# EasyEDA schematic SCH_NAVVIBE_2026-03-12.json
TITLE: Navvibe; REV: 1.0; Date: 2026-03-04; Sheet: 1/1; Drawn By: siudin22; Company: Your Company
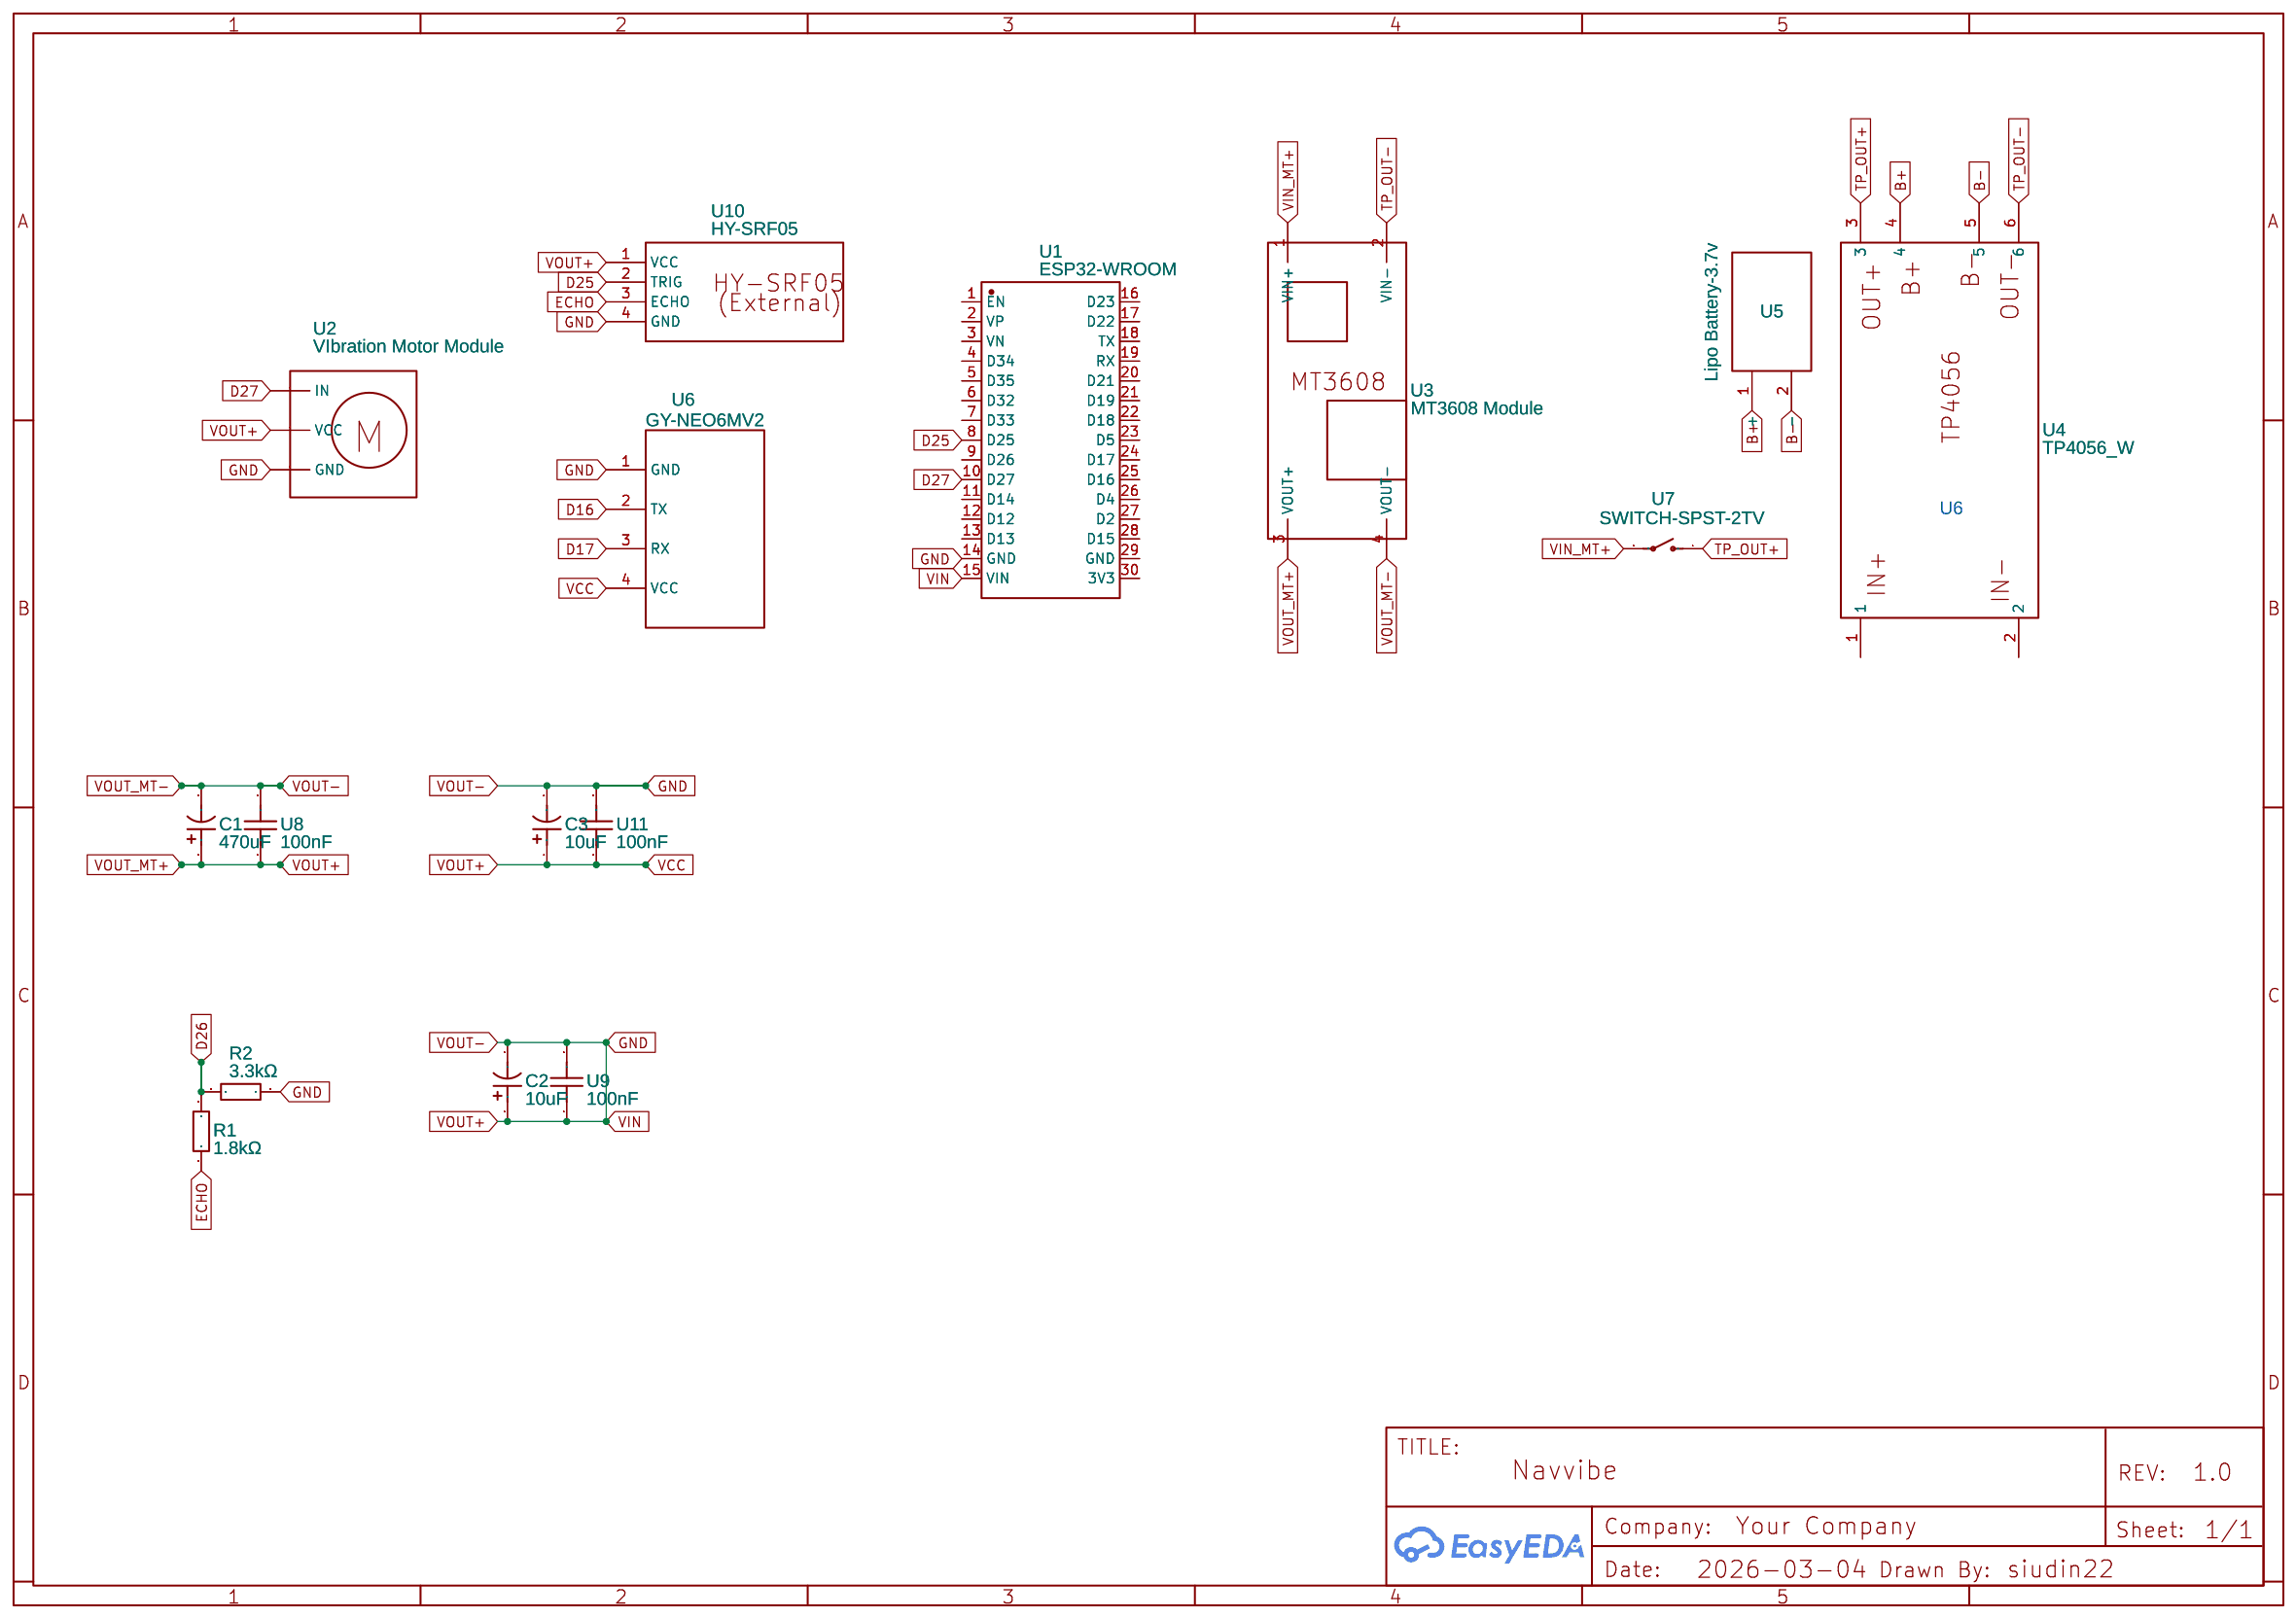
[diagram p0: schematic sheet]

## Parts
C1  470uF  [CAP-TH_BD6.0-P2.50-D0.5-FD]
C2  10uF  [CAP-TH_BD5.0-P2.00-D0.5-FD_RYHG35V10UF]
C3  10uF  [CAP-TH_BD5.0-P2.00-D0.5-FD_RYHG35V10UF]
R1  1.8kΩ  [RES-TH_BD3.3-L9.0-P13.00-D0.6]
R2  3.3kΩ  [RES-TH_BD3.3-L9.0-P13.00-D0.6]
U1  ESP32-WROOM  [ESP32 WROOM-32 ESP32-S JOY-IT]
U2  VIbration Motor Module  [VIBRATION MOTOR MODULE]
U3  MT3608 Module  [MT3608]
U4  TP4056_W  [TP4056_W]
U5  Lipo Battery-3.7v  [LIPO BATTERY-3.7V]
U6  GY-NEO6MV2  [GY-NEO6MV2]
U7  SWITCH-SPST-2TV  [SWITCH-SPST-VERTICAL]
U8  100nF  [CAP-TH_L12.0-W5.0-P10.00-D1.0]
U9  100nF  [CAP-TH_L12.0-W5.0-P10.00-D1.0]
U10  HY-SRF05  [HY_SRF05]
U11  100nF  [CAP-TH_L12.0-W5.0-P10.00-D1.0]

## Library data of the parts
C1 = 10V470UF CD288: Contributor: lcsc; Supplier: LCSC; Supplier Part: C2960213; Manufacturer: HRK(鸿瑞凯电子); Manufacturer Part: 10V470uF CD288; JLCPCB Part Class: Extended Part
C2 C3 = RYHG35V10UF5*8: Supplier: LCSC; Supplier Part: C48970423; Manufacturer: HONOR(荣誉); JLCPCB Part Class: Extended Part; Contributor: lcsc
R1 R2 = RN1/2W1.8KΩFT/BA1: Contributor: LCSC; Supplier: LCSC; Supplier Part: C385559; Manufacturer: Tyohm(幸亚电阻); JLCPCB Part Class: Extended Part
U1 = ESP32-WROOM: Supplier Part: C571181; Manufacturer: ESPRESSIF(乐鑫); Manufacturer Part: ESP32 WROOM-32 ESP32-S; JLCPCB Part Class: Extended Part; Contributor: maciekhka
U2 = VIbration Motor Module: Contributor: thomasdrive04
U3 = MT3608 Module: Supplier: Aliexpress; Contributor: Athantos
U4 = TP4056_W: Contributor: igor040885
U5 = Lipo Battery-3.7v: Contributor: noeltoms
U6 = GY-NEO6MV2: Contributor: james9987
U7 = SWITCH-SPST-2TV: Contributor: SparkFun
U8 U9 U11 = X2 104K310V_C2943725: Contributor: lcsc; Supplier: LCSC; Supplier Part: C2943725; Manufacturer: JURCC(捷威电子); Manufacturer Part: X2 104K310V; JLCPCB Part Class: Extended Part
U10 = HY-SRF05: Contributor: ihsannurhakim

## Nets
GND: C1.1 C1.2 C2.1 C2.2 C3.1 C3.2 R2.1 U1.14(GND) U1.15(VIN) U2.2(VCC) U2.3(GND) U3.3(VOUT+) U3.4(VOUT-) U6.1(GND) U6.4(VCC) U8.1 U8.2 U9.1 U9.2 U10.1(VCC) U10.4(GND) U11.1 U11.2
VIN_MT+: U3.1(VIN+) U7.2(P)
B+: U4.4
B-: U4.5
D16: U6.2(TX)
D17: U6.3(RX)
D25: U1.8(D25) U10.2(TRIG)
D26: R1.2 R2.2
D27: U1.10(D27) U2.1(IN)
ECHO: R1.1 U10.3(ECHO)
TP_OUT+: U4.3 U7.1(O)
TP_OUT-: U3.2(VIN-) U4.6

Not connected (* = marked no-connect by the designer): U1 1(EN) 2(VP) 3(VN) 4(D34) 5(D35) 6(D32) 7(D33) 9(D26) 11(D14) 12(D12) 13(D13) 16(D23) 17(D22) 18(TX) 19(RX) 20(D21) 21(D19) 22(D18) 23(D5) 24(D17) 25(D16) 26(D4) 27(D2) 28(D15) 29(GND) 30(3V3); U4 1 2; U5 1(+) 2(-)

## Notes on the sheet
- U6
